# Altium project cor-balance.PrjPCB
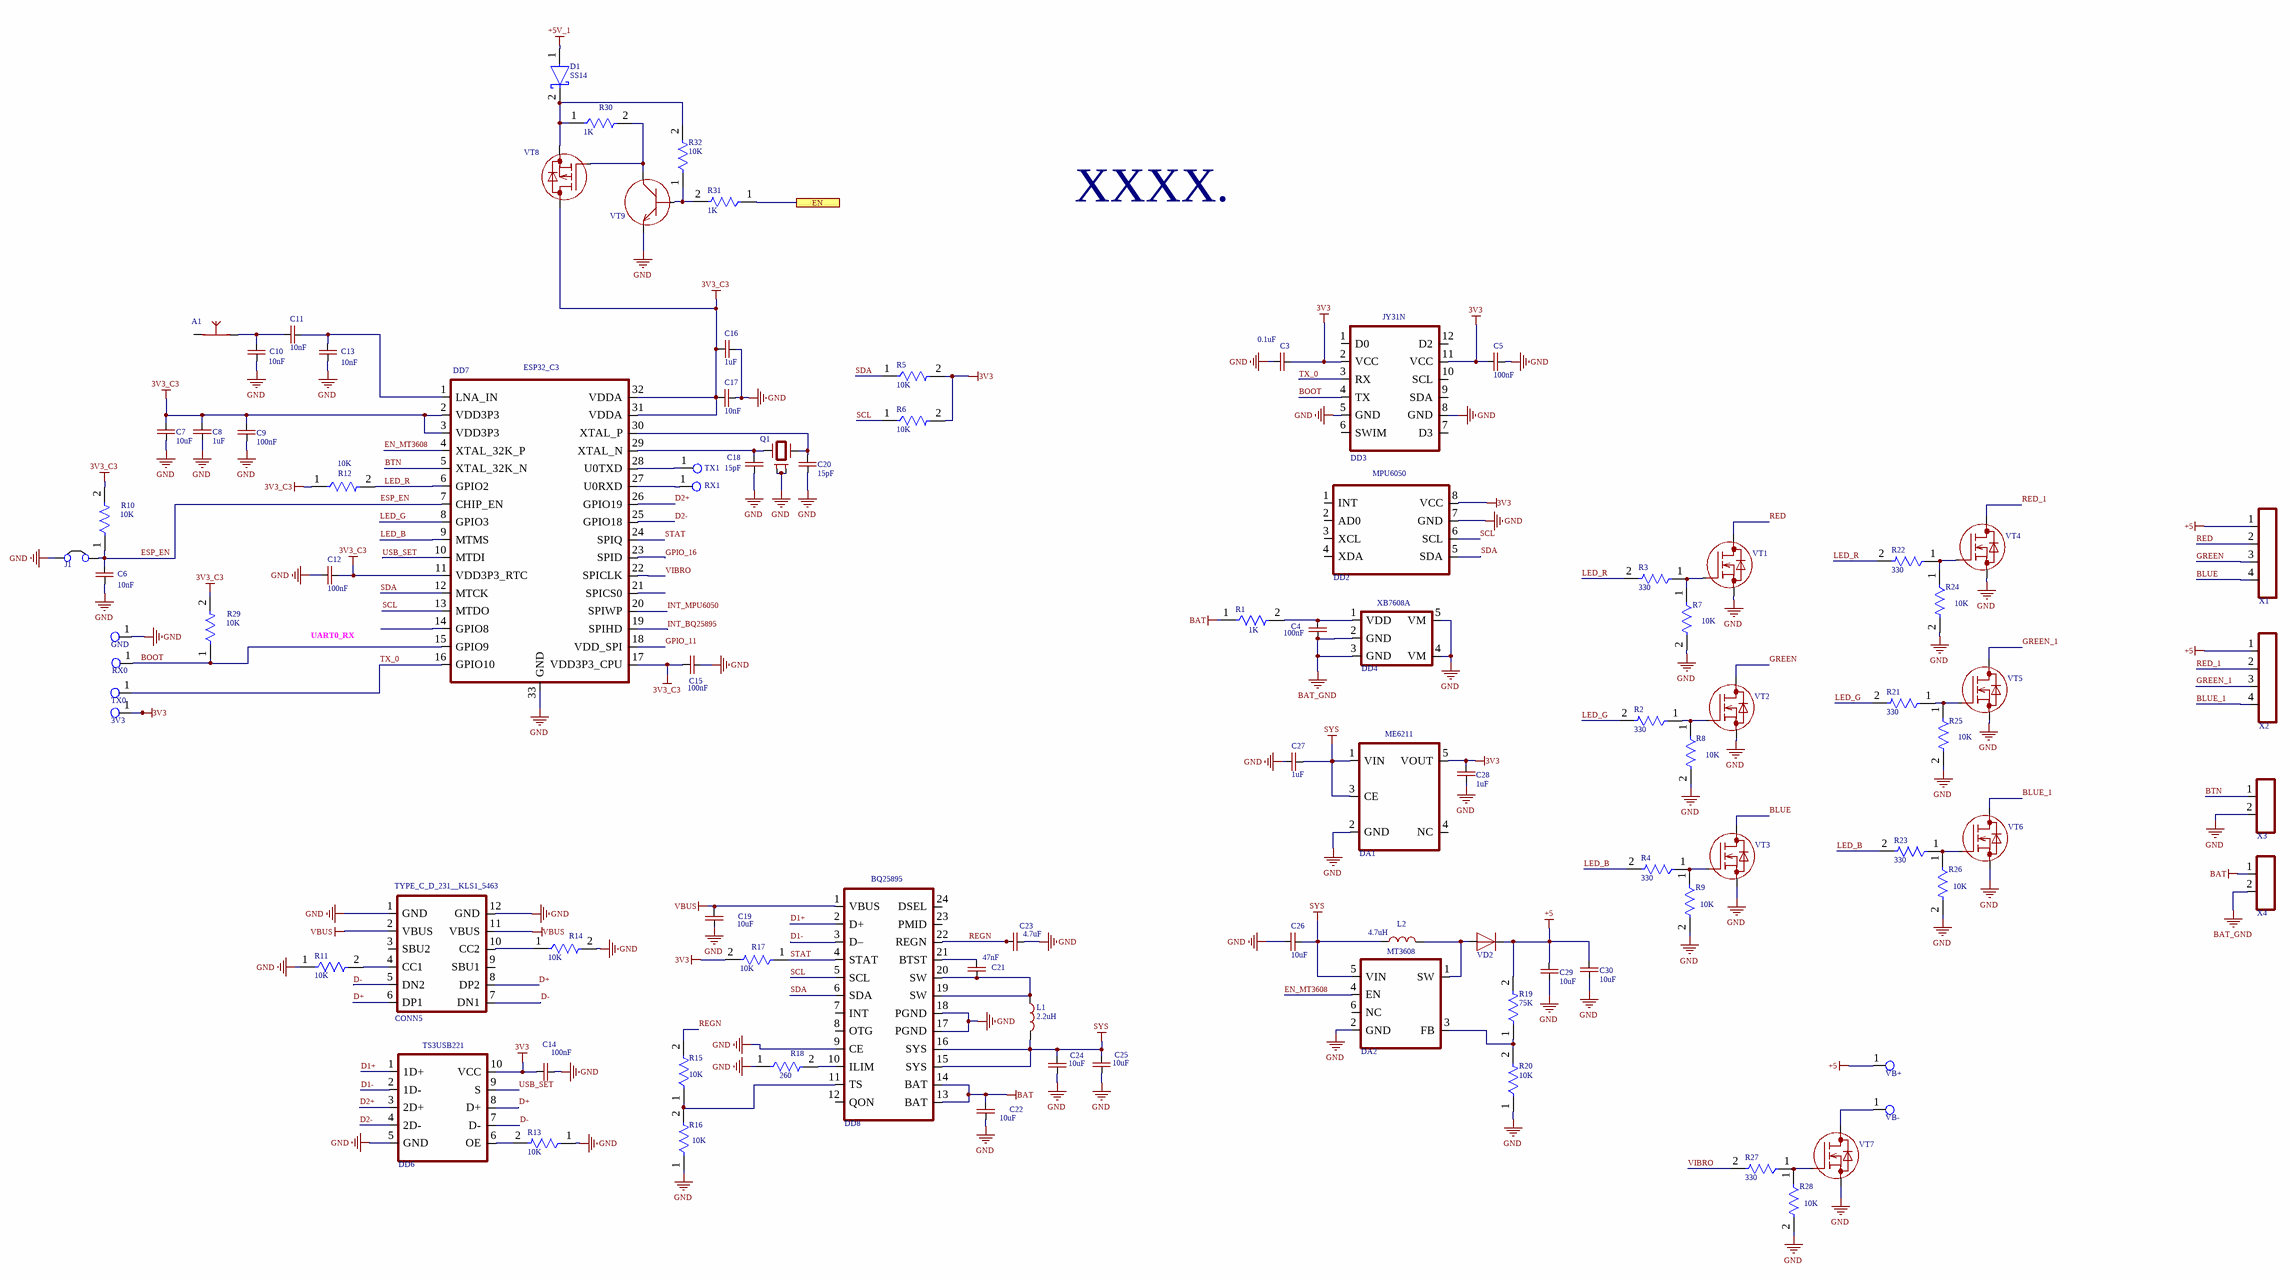
[diagram p0: cor-balance.SchDoc]
1 sheet, 97 parts. Net scope: flat (ports and power ports of the same name join across sheets).
Board file: cor-balance.PcbDoc

## Sheet cor-balance.SchDoc
size A1; SPICEModelCacheYQEDCYZF: <root> / <DocumentId>YQEDCYZF</DocumentId> / </root>

### Parts
3V3  Test_Point_PCB  [Test_Point]  (value not drawn)
A1  CA-C03  [CA-C03]  (value not drawn)
C3  0.1uF  [CAP-0603]
C4  100nF  [CAP-0805]
C5  100nF  [CAP-0603]
C6  10nF  [CAP-0603]
C7  10uF  [CAP-0603]
C8  1uF  [CAP-0603]
C9  100nF  [CAP-0603]
C10  10nF  [CAP-0402]
C11  10nF  [CAP-0402]
C12  100nF  [CAP-0603]
C13  10nF  [CAP-0402]
C14  100nF  [CAP-0402]
C15  100nF  [CAP-0603]
C16  1uF  [CAP-0603]
C17  10nF  [CAP-0603]
C18  15pF  [CAP-0402]
C19  10uF  [CAP-1206]
C20  15pF  [CAP-0402]
C21  47nF  [CAP-0603]
C22  10uF  [CAP-1206]
C23  4.7uF  [CAP-0805]
C24  10uF  [CAP-1206]
C25  10uF  [CAP-1206]
C26  10uF  [CAP-1206]
C27  1uF  [CAP-0805]
C28  1uF  [CAP-0805]
C29  10uF  [CAP-1206]
C30  10uF  [CAP-1206]
CONN5  TYPE_C_D_231__KLS1_5463  [TYPE-C-D-231__KLS1-5463]
D1  SS14  [DO-214-AC]
DA1  ME6211  [SOT23-5]
DA2  MT3608  [SOT23-6]
DD2  MPU6050  [MPU6050]
DD3  JY31N  [JY31N]
DD4  XB7608A  [XB7608A]
DD6  TS3USB221  [TS3USB221]
DD7  ESP32_C3  [QFN-32 (5x5)]
DD8  BQ25895  [WQFN-24]
GND  Test_Point_PCB  [Test_Point]  (value not drawn)
J1  Jumper 1x2.54  [Jumper_2.54]  (value not drawn)
L1  2.2uH  [SND_0504]
L2  4.7uH  [SND_0504]
Q1  OSC-4-PIN  [OSC-QSMD3.2x2.5x1.0]  (value not drawn)
R1  1K  [RES-0805]
R2  330  [RES-0805]
R3  330  [RES-0805]
R4  330  [RES-0805]
R5  10K  [RES-0603]
R6  10K  [RES-0603]
R7  10K  [RES-0805]
R8  10K  [RES-0805]
R9  10K  [RES-0805]
R10  10K  [RES-0603]
R11  10K  [RES-0603]
R12  10K  [RES-0603]
R13  10K  [RES-0402]
R14  10K  [RES-0603]
R15  10K  [RES-0603]
R16  10K  [RES-0603]
R17  10K  [RES-0603]
R18  260  [RES-0603]
R19  75K  [RES-0603]
R20  10K  [RES-0603]
R21  330  [RES-0805]
R22  330  [RES-0805]
R23  330  [RES-0805]
R24  10K  [RES-0805]
R25  10K  [RES-0805]
R26  10K  [RES-0805]
R27  330  [RES-0805]
R28  10K  [RES-0805]
R29  10K  [RES-0603]
R30  1K  [RES-0805]
R31  1K  [RES-0805]
R32  10K  [RES-0805]
RX0  Test_Point_PCB  [Test_Point]  (value not drawn)
RX1  Test_Point_PCB  [Test_Point]  (value not drawn)
TX0  Test_Point_PCB  [Test_Point]  (value not drawn)
TX1  Test_Point_PCB  [Test_Point]  (value not drawn)
VB+  Test_Point_PCB  [Test_Point]  (value not drawn)
VB-  Test_Point_PCB  [Test_Point]  (value not drawn)
VD2  DIODE  [DO-214AC, SMA]  (value not drawn)
VT1  MOSFET-N-GSD  [SOT23-3]  (value not drawn)
VT2  MOSFET-N-GSD  [SOT23-3]  (value not drawn)
VT3  MOSFET-N-GSD  [SOT23-3]  (value not drawn)
VT4  MOSFET-N-GSD  [SOT23-3]  (value not drawn)
VT5  MOSFET-N-GSD  [SOT23-3]  (value not drawn)
VT6  MOSFET-N-GSD  [SOT23-3]  (value not drawn)
VT7  MOSFET-N-GSD  [SOT23-3]  (value not drawn)
VT8  MOSFET-P-CH  [SOT23-3]  (value not drawn)
VT9  BC847-BEC  [SOT23-3]  (value not drawn)
X1  CONN-4-PIN  [CONN-PLS-4-2.54mm]  (value not drawn)
X2  CONN-4-PIN  [CONN-PLS-4-2.54mm]  (value not drawn)
X3  CONN-2-PIN  [CONN-PLS-2-2.54mm]  (value not drawn)
X4  CONN-2-PIN  [CONN-PLS-2-2.54mm]  (value not drawn)

### Ports
EN

### Nets
3V3: 3V3.1(G9) C3.1 C5.2 C14.2 C28.1 DA1.5(VOUT) DD2.8(VCC) DD3.2(VCC) DD3.11(VCC) DD6.10(VCC) R5.2 R6.2 R17.2
3V3_С3: C7.2 C8.2 C9.2 C12.1 C15.1 C16.1 C17.2 DD7.2(VDD3P3) DD7.3(VDD3P3) DD7.11(VDD3P3_RTC) DD7.17(VDD3P3_CPU) DD7.31(VDDA) DD7.32(VDDA) R10.2 R12.1 R29.2 VT8.3(D)
+5: C29.1 C30.1 R19.2 VB+.1(G9) VD2.1(C) X1.1 X2.1
+5V_1: D1.1(A)
BAT: C22.2 DD8.13(BAT) DD8.14(BAT) R1.1 X4.1
BAT_GND: C4.1 DD4.2(GND) DD4.3(GND) X4.2
GND: C3.2 C5.1 C6.2 C7.1 C8.1 C9.1 C10.2 C12.2 C13.2 C14.1 C15.2 C16.2 C17.1 C18.1 C19.1 C20.1 C22.1 C23.1 C24.1 C25.1 C26.2 C27.2 C28.2 C29.2 C30.2 CONN5.1(GND) CONN5.12(GND) DA1.2(GND) DA2.2(GND) DD2.7(GND) DD3.5(GND) DD3.8(GND) DD4.4(VM) DD4.5(VM) DD6.5(GND) DD7.33(GND) DD8.9(CE) DD8.17(PGND) DD8.18(PGND) GND.1(G9) J1.1 Q1.2 Q1.4 R7.2 R8.2 R9.2 R11.1 R13.1 R14.2 R16.1 R18.1 R20.1 R24.2 R25.2 R26.2 R28.2 VT1.2(S) VT2.2(S) VT3.2(S) VT4.2(S) VT5.2(S) VT6.2(S) VT7.2(S) VT9.2(E) X3.2
SYS: C24.2 C25.2 C26.1 C27.1 DA1.1(VIN) DA1.3(CE) DA2.5(VIN) DD8.15(SYS) DD8.16(SYS) L1.2 L2.1
VBUS: C19.2 CONN5.2(VBUS) CONN5.11(VBUS) DD8.1(VBUS)
BLUE: VT3.3(D) X1.4
BLUE_1: VT6.3(D) X2.4
BOOT: DD3.4(TX) DD7.15(GPIO9) R29.1 RX0.1(G9)
BTN: DD7.5(XTAL_32K_N) X3.1
D1+: DD6.1(1D+) DD8.2(D+)
D1-: DD6.2(1D-) DD8.3(D–)
D2+: DD6.3(2D+) DD7.26(GPIO19)
D2-: DD6.4(2D-) DD7.25(GPIO18)
D+: CONN5.6(DP1) CONN5.8(DP2) DD6.8(D+)
D-: CONN5.5(DN2) CONN5.7(DN1) DD6.7(D-)
EN_MT3608: DA2.4(EN) DD7.4(XTAL_32K_P)
ESP_EN: C6.1 DD7.7(CHIP_EN) J1.2 R10.1
GPIO_11: DD7.18(VDD_SPI)
GPIO_16: DD7.23(SPID)
GREEN: VT2.3(D) X1.3
GREEN_1: VT5.3(D) X2.3
INT_BQ25895: DD7.19(SPIHD)
INT_MPU6050: DD7.20(SPIWP)
LED_B: DD7.9(MTMS) R4.2 R23.2
LED_G: DD7.8(GPIO3) R2.2 R21.2
LED_R: DD7.6(GPIO2) R3.2 R12.2 R22.2
RED: VT1.3(D) X1.2
RED_1: VT4.3(D) X2.2
REGN: C23.2 DD8.22(REGN) R15.2
SCL: DD2.6(SCL) DD7.13(MTDO) DD8.5(SCL) R6.1
SDA: DD2.5(SDA) DD7.12(MTCK) DD8.6(SDA) R5.1
STAT: DD7.24(SPIQ) DD8.4(STAT) R17.1
TX_0: DD3.3(RX) DD7.16(GPIO10) TX0.1(G9)
USB_SET: DD6.9(S) DD7.10(MTDI)
VIBRO: DD7.22(SPICLK) R27.2
NetA1_1: A1.1 C10.1 C11.1
NetC4_2: C4.2 DD4.1(VDD) R1.2
NetC11_2: C11.2 C13.1 DD7.1(LNA_IN)
NetC18_2: C18.2 DD7.29(XTAL_N) Q1.1
NetC20_2: C20.2 DD7.30(XTAL_P) Q1.3
NetC21_1: C21.1 DD8.19(SW) DD8.20(SW) L1.1
NetC21_2: C21.2 DD8.21(BTST)
NetCONN5_4: CONN5.4(CC1) R11.2
NetCONN5_10: CONN5.10(CC2) R14.1
NetD1_2: D1.2(C) R30.1 R32.2 VT8.2(S)
NetDA2_1: DA2.1(SW) L2.2 VD2.2(A)
NetDA2_3: DA2.3(FB) R19.1 R20.2
NetDD6_6: DD6.6(OE) R13.2
NetDD7_27: DD7.27(U0RXD) RX1.1(G9)
NetDD7_28: DD7.28(U0TXD) TX1.1(G9)
NetDD8_10: DD8.10(ILIM) R18.2
NetDD8_11: DD8.11(TS) R15.1 R16.2
NetR2_1: R2.1 R8.1 VT2.1(G)
NetR3_1: R3.1 R7.1 VT1.1(G)
NetR4_1: R4.1 R9.1 VT3.1(G)
NetR21_1: R21.1 R25.1 VT5.1(G)
NetR22_1: R22.1 R24.1 VT4.1(G)
NetR23_1: R23.1 R26.1 VT6.1(G)
NetR27_1: R27.1 R28.1 VT7.1(G)
NetR30_2: R30.2 VT8.1(G) VT9.3(C)
NetR31_1: R31.1 ; port EN
NetR31_2: R31.2 R32.1 VT9.1(B)
NetVB-_1: VB-.1(G9) VT7.3(D)

Not connected (* = marked no-connect by the designer): A1 2; CONN5 3(SBU2) 9(SBU1); DA1 4(NC); DA2 6(NC); DD2 1(INT) 2(AD0) 3(XCL) 4(XDA); DD3 1(D0) 6(SWIM) 7(D3) 9(SDA) 10(SCL) 12(D2); DD7 14(GPIO8) 21(SPICS0); DD8 7(INT) 8(OTG) 12(QON) 23(PMID) 24(DSEL)

### Notes on the sheet
- XXXX.
- Labels drawn without touching a wire or pin: ESP_EN, UART0_RX

### Library data of the parts
3V3 GND RX0 RX1 TX0 TX1 VB+ VB- = TP_PCB?: Test_Point
C3-C30 = CAP-NON-POLAR
L1 L2 = IND-CONST
R1-R4 R21-R23 R27 = RES-CONST: 10K
R5-R20 R24-R26 R28-R32 = RES-CONST